# EAGLE schematic Respirador_Motor (EAGLE 9.4.2)
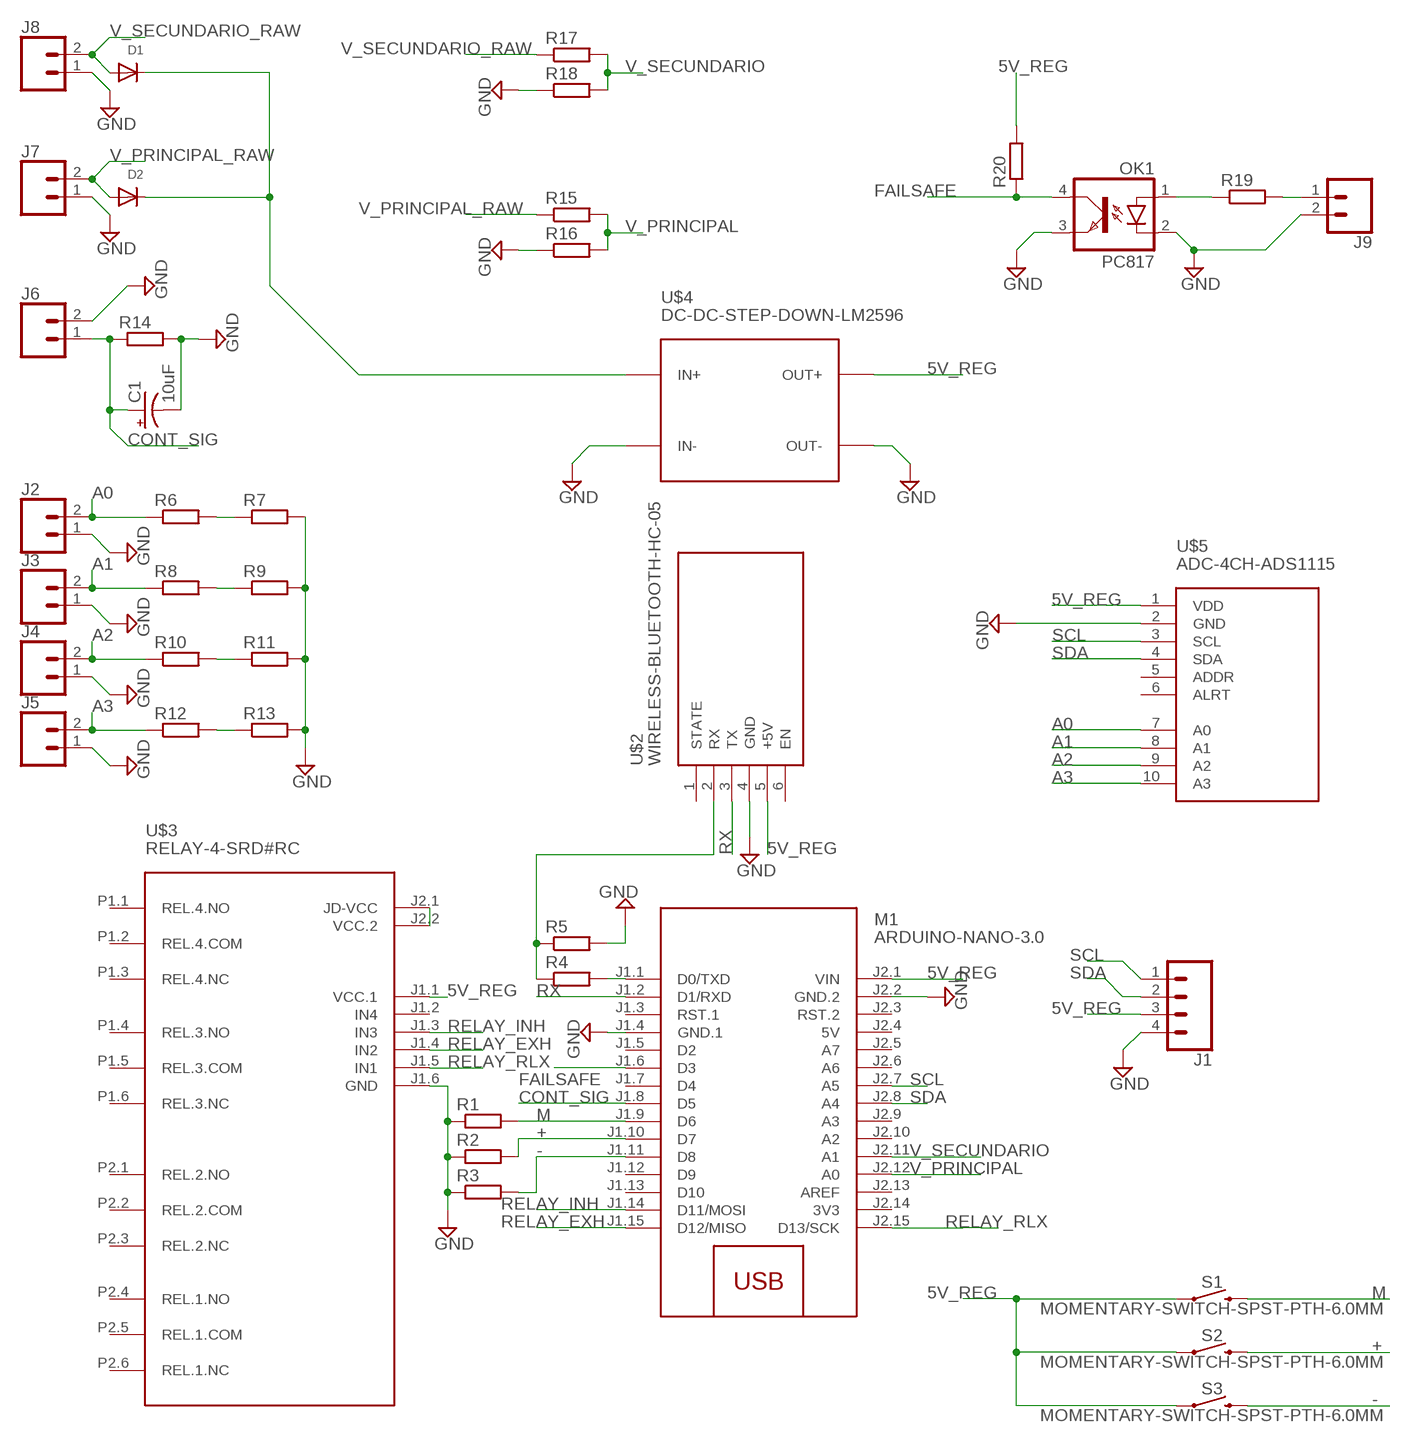
[diagram p0: schematic, sheet 1]

## Parts
C1  10uF  10UF-TANT  [EIA3216]
D1  DIODEDO-1N4148  [DO-1N4148]
D2  DIODEDO-1N4148  [DO-1N4148]
J1  CONN_04  [1X04]
J2  CONN_025MM  [SCREWTERMINAL-5MM-2]
J3  CONN_025MM  [SCREWTERMINAL-5MM-2]
J4  CONN_025MM  [SCREWTERMINAL-5MM-2]
J5  CONN_025MM  [SCREWTERMINAL-5MM-2]
J6  CONN_025MM  [SCREWTERMINAL-5MM-2]
J7  CONN_025MM  [SCREWTERMINAL-5MM-2]
J8  CONN_025MM  [SCREWTERMINAL-5MM-2]
J9  CONN_025MM  [SCREWTERMINAL-5MM-2]
M1  ARDUINO-NANO-3.0  [ARDUINO-NANO-3.0]
OK1  PC817  [DIL04]
R1  R-EU_0207/10  [0207/10]
R2  R-EU_0207/10  [0207/10]
R3  R-EU_0207/10  [0207/10]
R4  R-EU_0207/10  [0207/10]
R5  R-EU_0207/10  [0207/10]
R6  R-EU_0207/10  [0207/10]
R7  R-EU_0207/10  [0207/10]
R8  R-EU_0207/10  [0207/10]
R9  R-EU_0207/10  [0207/10]
R10  R-EU_0207/10  [0207/10]
R11  R-EU_0207/10  [0207/10]
R12  R-EU_0207/10  [0207/10]
R13  R-EU_0207/10  [0207/10]
R14  R-EU_0207/10  [0207/10]
R15  R-EU_0207/10  [0207/10]
R16  R-EU_0207/10  [0207/10]
R17  R-EU_0207/10  [0207/10]
R18  R-EU_0207/10  [0207/10]
R19  R-EU_0207/10  [0207/10]
R20  R-EU_0207/10  [0207/10]
S1  MOMENTARY-SWITCH-SPST-PTH-6.0MM  [TACTILE_SWITCH_PTH_6.0MM]
S2  MOMENTARY-SWITCH-SPST-PTH-6.0MM  [TACTILE_SWITCH_PTH_6.0MM]
S3  MOMENTARY-SWITCH-SPST-PTH-6.0MM  [TACTILE_SWITCH_PTH_6.0MM]
U$2  WIRELESS-BLUETOOTH-HC-05  [WIRELESS-BLUETOOTH-HC-05]
U$3  RELAY-4-SRD#RC  [RELAY-4-SRD#RC]
U$4  DC-DC-STEP-DOWN-LM2596  [DC-DC-STEP-DOWN-LM2596]
U$5  ADC-4CH-ADS1115  [ADC-4CH-ADS1115]

## Nets
5V_REG: J1.3 M1.J2.1(VIN) R20.2 S1.1 S2.1 S3.1 U$2.5(+5V) U$3.J1.1(VCC.1) U$4.OUT+ U$5.1(VDD)
+: M1.J1.10(D7) R2.2 S2.3
-: M1.J1.11(D8) R3.2 S3.3
A0: J2.2 R6.1 U$5.7(A0)
A1: J3.2 R8.1 U$5.8(A1)
A2: J4.2 R10.1 U$5.9(A2)
A3: J5.2 R12.1 U$5.10(A3)
CONT_SIG: C1.A(+) J6.1 M1.J1.8(D5) R14.1
FAILSAFE: M1.J1.6(D3) OK1.4(COL) R20.1
GND: C1.C(-) J1.4 J2.1 J3.1 J4.1 J5.1 J6.2 J7.1 J8.1 J9.2 M1.J1.4(GND.1) M1.J2.2(GND.2) OK1.2(C) OK1.3(EMIT) R1.1 R2.1 R3.1 R5.2 R7.2 R9.2 R11.2 R13.2 R14.2 R16.1 R18.1 U$2.4(GND) U$3.J1.6(GND) U$4.IN- U$4.OUT- U$5.2(GND)
M: M1.J1.9(D6) R1.2 S1.3
N$1: R6.2 R7.1
N$2: R8.2 R9.1
N$3: R10.2 R11.1
N$7: M1.J1.1(D0/TXD) R4.2
N$8: R12.2 R13.1
N$9: J9.1 R19.2
N$10: D1.C D2.C U$4.IN+
N$11: R4.1 R5.1 U$2.2(RX)
N$12: U$3.J2.1(JD-VCC) U$3.J2.2(VCC.2)
N$13: OK1.1(A) R19.1
RELAY_EXH: M1.J1.15(D12/MISO) U$3.J1.4(IN2)
RELAY_INH: M1.J1.14(D11/MOSI) U$3.J1.3(IN3)
RELAY_RLX: M1.J2.15(D13/SCK) U$3.J1.5(IN1)
RX: M1.J1.2(D1/RXD) U$2.3(TX)
SCL: J1.1 M1.J2.7(A5) U$5.3(SCL)
SDA: J1.2 M1.J2.8(A4) U$5.4(SDA)
V_PRINCIPAL: M1.J2.12(A0) R15.2 R16.2
V_PRINCIPAL_RAW: D2.A J7.2 R15.1
V_SECUNDARIO: M1.J2.11(A1) R17.2 R18.2
V_SECUNDARIO_RAW: D1.A J8.2 R17.1
Unconnected: M1.J1.3(RST.1) M1.J1.5(D2) M1.J1.7(D4) M1.J1.12(D9) M1.J1.13(D10) M1.J2.3(RST.2) M1.J2.5(A7) M1.J2.6(A6) M1.J2.9(A3) M1.J2.10(A2) M1.J2.13(AREF) U$2.1(STATE) U$2.6(EN) U$3.J1.2(IN4) U$3.P1.1(REL.4.NO) U$3.P1.2(REL.4.COM) U$3.P1.3(REL.4.NC) U$3.P1.4(REL.3.NO) U$3.P1.5(REL.3.COM) U$3.P1.6(REL.3.NC) U$3.P2.1(REL.2.NO) U$3.P2.2(REL.2.COM) U$3.P2.3(REL.2.NC) U$3.P2.4(REL.1.NO) U$3.P2.5(REL.1.COM) U$3.P2.6(REL.1.NC) U$5.5(ADDR) U$5.6(ALRT)

## Power pins joined to a net without a drawn wire
3V3: M1.J2.14(3V3)
5V: M1.J2.4(5V)

## Library data of the parts
C1 = SparkFun-Retired:10UF-TANT: 10uF Tantalum SMT CAP-00811- 16V 10% (EIA-3216); PROD_ID: CAP-00811
D1 D2 = adafruit:DIODE: Diode SMADIODE - SMA Surface Mount Package 20V 1A Schottky Diode Digikey: 641-1014-6-ND DO-1N4148 - Through Hole Small Current Diode SOD-123 20V 1 A (.5mV Vf) Schottky Diode - Digikey: MBRX120TPMSCT-ND SOD-323 10V 570mA (.38mV Vf, 3ns) Schottky Diode - Digikey: ZLLS410CT-ND SOD-523 30V 30mA Schottky Diode (RB751S-40TE61) - Digikey: RB751S-40TE61CT-ND SOT23-R/W - SOT23 Package (R = Solder Paste/Reflow Ovens, W = Hand-Soldering) BAT54Film 40V 300mA - Digikey: 497-7162-1-ND
J1 = SparkFun-Connectors:CONN_04: Multi connection point. Often used as Generic Header-pin footprint for 0.1 inch spaced/style header connections On any of the 0.1 inch spaced packages, you can populate with these: Break Away Headers - Straight <https://www.sparkfun.com/products/116> (PRT-00116) Break Away Male Headers - Right Angle <https://www.sparkfun.com/products/553> (PRT-00553) Female Headers <https://www.sparkfun.com/products/115> (PRT-00115) Break Away Headers - Machine Pin <https://www.sparkfun.com/products/117> (PRT-00117) Break Away Female Headers - Swiss Machine Pin <https://www.sparkfun.com/products/743> (PRT-00743) For SCREWTERMINALS and SPRING TERMINALS visit here: Screw Terimnals on SparkFun.com <https://www.sparkfun.com/search/results?term=Screw+Terminals> (5mm/3.5mm/2.54mm spacing) This device is also useful as a general connection point to wire up your design to another part of your project. Our various solder wires solder well into these plated through hole pads. Hook-Up Wire - Assortment (Stranded, 22 AWG) <https://www.sparkfun.com/products/11375> (PRT-11375) Hook-Up Wire - Assortment (Solid Core, 22 AWG) <https://www.sparkfun.com/products/11367> (PRT-11367) View the entire wire category on our website here <https://www.sparkfun.com/categories/141> Special notes: Molex polarized connector foot print use with SKU : PRT-08231 with associated crimp pins and housings. 1MM SMD Version SKU: PRT-10208; PROD_ID: CONN-09696
J2-J9 = SparkFun-Connectors:CONN_02: Multi connection point. Often used as Generic Header-pin footprint for 0.1 inch spaced/style header connections On any of the 0.1 inch spaced packages, you can populate with these: Break Away Headers - Straight <https://www.sparkfun.com/products/116> (PRT-00116) Break Away Male Headers - Right Angle <https://www.sparkfun.com/products/553> (PRT-00553) Female Headers <https://www.sparkfun.com/products/115> (PRT-00115) Break Away Headers - Machine Pin <https://www.sparkfun.com/products/117> (PRT-00117) Break Away Female Headers - Swiss Machine Pin <https://www.sparkfun.com/products/743> (PRT-00743) For SCREWTERMINALS and SPRING TERMINALS visit here: Screw Terimnals on SparkFun.com <https://www.sparkfun.com/search/results?term=Screw+Terminals> (5mm/3.5mm/2.54mm spacing) This device is also useful as a general connection point to wire up your design to another part of your project. Our various solder wires solder well into these plated through hole pads. Hook-Up Wire - Assortment (Stranded, 22 AWG) <https://www.sparkfun.com/products/11375> (PRT-11375) Hook-Up Wire - Assortment (Solid Core, 22 AWG) <https://www.sparkfun.com/products/11367> (PRT-11367) View the entire wire category on our website here <https://www.sparkfun.com/categories/141> Special notes: Molex polarized connector foot print use with: PRT-08233 with associated crimp pins and housings. 2.54_SCREWTERM for use with PRT-10571. 3.5mm Screw Terminal footprints for PRT-08084 5mm Screw Terminal footprints for use with PRT-08432; SF_SKU: PRT-08432
M1 = diy-modules:ARDUINO-NANO-3.0: Arduino Nano 3.0
OK1 = optocoupler:PC817: SHARP OPTO COUPLER; MPN: PC817X4J000F; OC_FARNELL: 9707727; OC_NEWARK: 97K7059
R1-R20 = resistor:R-EU_: RESISTOR, European symbol
S1-S3 = SparkFun-Switches:MOMENTARY-SWITCH-SPST: Momentary Switch (Pushbutton) - SPST Normally-open (NO) SPST momentary switches (buttons, pushbuttons). Variants PTH-12MM - 12mm square, through-hole Momentary Pushbutton Switch - 12mm Square <https://www.sparkfun.com/products/9190> (COM-09190) PTH-6.0MM, PTH-6.0MM-KIT - 6.0mm square, through-hole Mini Pushbutton Switch <https://www.sparkfun.com/products/97> (COM-00097) KIT package intended for soldering kit's - only one side of pads' copper is exposed. PTH-RIGHT-ANGLE-KIT - Right-angle, through-hole Right Angle Tactile Button <https://www.sparkfun.com/products/10791> - Used on SparkFun BigTime Watch Kit <https://www.sparkfun.com/products/11734> SMD-12MM - 12mm square, surface-mount Tactile Button - SMD (12mm) <https://www.sparkfun.com/products/12993> (COM-12993) Used on SparkFun PicoBoard <https://www.sparkfun.com/products/11888> SMD-4.5MM - 4.5mm Square Trackball Switch Used on SparkFun Blackberry Trackballer Breakout <https://www.sparkfun.com/products/13169> SMD-4.6MMX2.8MM - 4.60mm x 2.80mm, surface mount Used on SparkFun SAMD21 Mini Breakout <https://www.sparkfun.com/products/13664> SMD-5.2MM, SMD-5.2-REDUNDANT - 5.2mm square, surface-mount Mini Pushbutton Switch - SMD <https://www.sparkfun.com/products/8720> (COM-08720) Used on Arduino Pro Mini <https://www.sparkfun.com/products/11114> REDUNDANT package connects both switch circuits together SMD-6.0X3.5MM - 6.0 x 3.5mm, surface mount Momentary Reset Switch SMD <https://www.sparkfun.com/products/8229> (COM-08229) SMD-6.2MM-TALL - 6.2mm square, surface mount Tactile Button - SMD (6mm) <https://www.sparkfun.com/products/12992> Used on SparkFun Digital Sandbox <https://www.sparkfun.com/products/12651> SMD-RIGHT-ANGLE - Right-angle, surface mount Used on SparkFun Block for Intel® Edison - Arduino <https://www.sparkfun.com/products/13036>; PROD_ID: SWCH-08441; SF_SKU: COM-00097
U$2 = diy-modules(1):WIRELESS-BLUETOOTH-HC-05: Bluetooth Transceiver Module based on HC-05 board Tutorial is available here: https://arduino-info.wikispaces.com/BlueTooth-HC05-HC06-Modules-How-To Click here to find device on ebay.com <http://www.ebay.com/sch/hc-05+module+rs232>
U$3 = diy-modules(1):RELAY-4-SRD#RC: 4-Channel Relay Module based on SRD-05VDC-SL-C relays Symbol with relays pins Click here to find device on ebay.com <http://www.ebay.com/sch/four+channel+relay+module+optocoupler+5v>
U$4 = diy-modules:DC-DC-STEP-DOWN-LM2596: DC/DC Step-Down Regulator based on LM2596-ADJ chip
U$5 = diy-modules(1):ADC-4CH-ADS1115: 4 Channel 16-Bit Analog-to-Digital Converter based on ADS1115 chip Arduino ADS1115 Getting Started Tutorial is available here: http://henrysbench.capnfatz.com/henrys-bench/arduino-voltage-measurements/arduino-ads1115-module-getting-started-tutorial/ ADS1115 datasheet is available here: http://www.ti.com/lit/ds/symlink/ads1115.pdf Click here to find device on ebay.com <http://www.ebay.com/sch/ads1115+module>